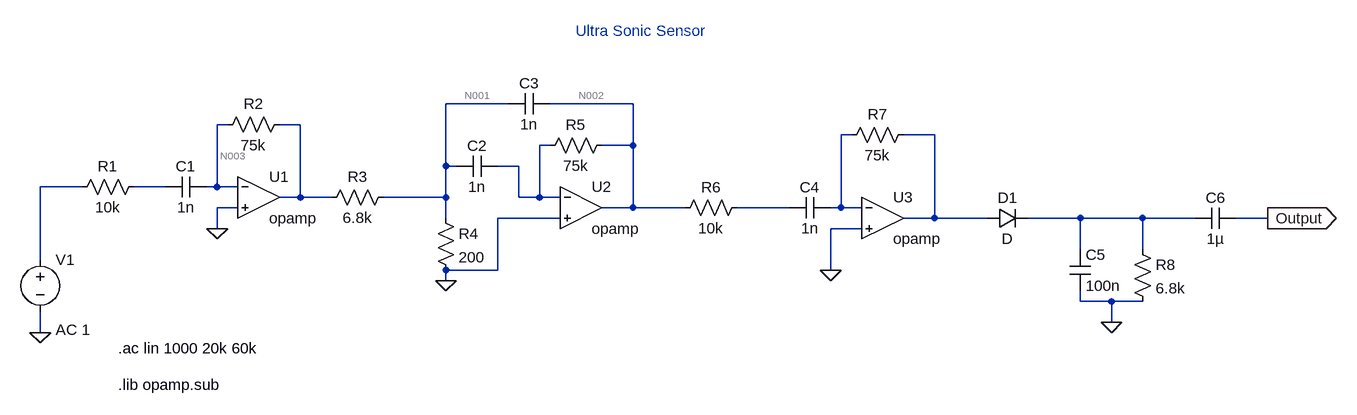
[diagram p0: schematic Ultrasonic.asc]
Ultrasonic.asc, the LTspice schematic file:
Version 4
SHEET 1 2076 712
WIRE 768 64 672 64
WIRE 960 64 832 64
WIRE 336 96 320 96
WIRE 448 96 416 96
WIRE 1296 112 1280 112
WIRE 1424 112 1376 112
WIRE 832 128 816 128
WIRE 960 128 960 64
WIRE 960 128 912 128
WIRE 672 160 672 64
WIRE 688 160 672 160
WIRE 784 160 752 160
WIRE 112 192 48 192
WIRE 240 192 192 192
WIRE 320 192 320 96
WIRE 320 192 304 192
WIRE 352 192 320 192
WIRE 448 208 448 96
WIRE 448 208 416 208
WIRE 496 208 448 208
WIRE 672 208 672 160
WIRE 672 208 576 208
WIRE 784 208 784 160
WIRE 816 208 816 128
WIRE 816 208 784 208
WIRE 848 208 816 208
WIRE 352 224 320 224
WIRE 960 224 960 128
WIRE 960 224 912 224
WIRE 1040 224 960 224
WIRE 1200 224 1120 224
WIRE 1280 224 1280 112
WIRE 1280 224 1264 224
WIRE 1312 224 1280 224
WIRE 672 240 672 208
WIRE 848 240 752 240
WIRE 1424 240 1424 112
WIRE 1424 240 1376 240
WIRE 1504 240 1424 240
WIRE 1648 240 1568 240
WIRE 1744 240 1648 240
WIRE 1824 240 1744 240
WIRE 1936 240 1888 240
WIRE 320 256 320 224
WIRE 1312 256 1264 256
WIRE 1648 288 1648 240
WIRE 1744 288 1744 240
WIRE 48 304 48 192
WIRE 752 320 752 240
WIRE 752 320 672 320
WIRE 1264 320 1264 256
WIRE 672 336 672 320
WIRE 1648 368 1648 352
WIRE 1696 368 1648 368
WIRE 1744 368 1696 368
WIRE 1696 400 1696 368
WIRE 48 416 48 384
FLAG 320 256 0
FLAG 672 336 0
FLAG 1696 400 0
FLAG 1264 320 0
FLAG 1936 240 Output
IOPIN 1936 240 Out
FLAG 48 416 0
SYMBOL res 208 176 R90
WINDOW 0 0 56 VBottom 2
WINDOW 3 32 56 VTop 2
SYMATTR InstName R1
SYMATTR Value 10k
SYMBOL cap 304 176 R90
WINDOW 0 0 32 VBottom 2
WINDOW 3 32 32 VTop 2
SYMATTR InstName C1
SYMATTR Value 1n
SYMBOL OpAmps\\opamp 384 144 R0
SYMATTR InstName U1
SYMBOL res 432 80 R90
WINDOW 0 0 56 VBottom 2
WINDOW 3 32 56 VTop 2
SYMATTR InstName R2
SYMATTR Value 75k
SYMBOL res 592 192 R90
WINDOW 0 0 56 VBottom 2
WINDOW 3 32 56 VTop 2
SYMATTR InstName R3
SYMATTR Value 6.8k
SYMBOL res 656 224 R0
SYMATTR InstName R4
SYMATTR Value 200
SYMBOL cap 752 144 R90
WINDOW 0 0 32 VBottom 2
WINDOW 3 32 32 VTop 2
SYMATTR InstName C2
SYMATTR Value 1n
SYMBOL cap 832 48 R90
WINDOW 0 0 32 VBottom 2
WINDOW 3 32 32 VTop 2
SYMATTR InstName C3
SYMATTR Value 1n
SYMBOL OpAmps\\opamp 880 160 R0
SYMATTR InstName U2
SYMBOL res 928 112 R90
WINDOW 0 0 56 VBottom 2
WINDOW 3 32 56 VTop 2
SYMATTR InstName R5
SYMATTR Value 75k
SYMBOL res 1136 208 R90
WINDOW 0 0 56 VBottom 2
WINDOW 3 32 56 VTop 2
SYMATTR InstName R6
SYMATTR Value 10k
SYMBOL cap 1264 208 R90
WINDOW 0 0 32 VBottom 2
WINDOW 3 32 32 VTop 2
SYMATTR InstName C4
SYMATTR Value 1n
SYMBOL OpAmps\\opamp 1344 176 R0
SYMATTR InstName U3
SYMBOL res 1392 96 R90
WINDOW 0 0 56 VBottom 2
WINDOW 3 32 56 VTop 2
SYMATTR InstName R7
SYMATTR Value 75k
SYMBOL diode 1504 256 R270
WINDOW 0 32 32 VTop 2
WINDOW 3 0 32 VBottom 2
SYMATTR InstName D1
SYMBOL res 1728 272 R0
SYMATTR InstName R8
SYMATTR Value 6.8k
SYMBOL cap 1632 288 R0
SYMATTR InstName C5
SYMATTR Value 100n
SYMBOL cap 1888 224 R90
WINDOW 0 0 32 VBottom 2
WINDOW 3 32 32 VTop 2
SYMATTR InstName C6
SYMATTR Value 1µ
SYMBOL voltage 48 288 R0
WINDOW 123 24 124 Left 2
WINDOW 39 0 0 Left 0
SYMATTR Value2 AC 1
SYMATTR InstName V1
SYMATTR Value ""
TEXT 168 440 Left 2 !.ac lin 1000 20k 60k
TEXT 168 496 Left 2 !.lib opamp.sub
TEXT 872 -48 Left 2 ;Ultra Sonic Sensor

The netlist it stands for:
* Ultrasonic.asc
R1 N009 N008 10k
C1 N003 N009 1n
XU1 N003 0 N004 opamp Aol=100K GBW=10Meg  ; pins invin noninvin out
R2 N004 N003 75k
R3 N001 N004 6.8k
R4 N001 0 200
C2 N007 N001 1n
C3 N002 N001 1n
XU2 N007 0 N002 opamp Aol=100K GBW=10Meg  ; pins invin noninvin out
R5 N002 N007 75k
R6 N010 N002 10k
C4 N005 N010 1n
XU3 N005 0 N006 opamp Aol=100K GBW=10Meg  ; pins invin noninvin out
R7 N006 N005 75k
D1 N006 N011 D
R8 N011 0 6.8k
C5 N011 0 100n
C6 Output N011 1µ
V1 N008 0 AC 1
.model D D
.lib standard.dio
.ac lin 1000 20k 60k
.lib opamp.sub
* Ultra Sonic Sensor
.backanno
.end

* Results of the author's LTspice run, read from the files saved beside the schematic
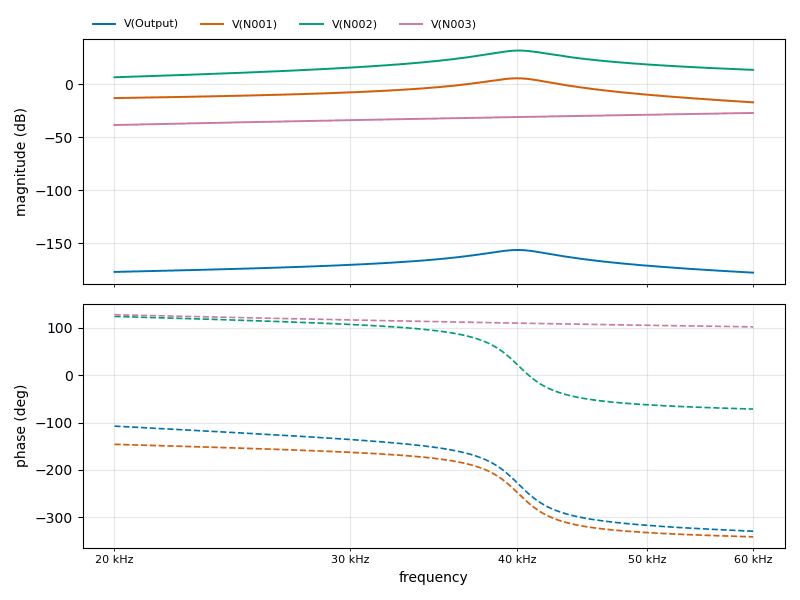
[diagram p1: AC Analysis of Ultrasonic.asc, plotted from the saved traces]
* AC Analysis, 1 run:
*   V(Output): -177.21 dB at 20 kHz, -177.89 dB at 60 kHz, peak -156.49 dB at 40.02 kHz, 3 dB below the peak at 38.02 kHz and 41.96 kHz
*   V(N001): -13.15 dB at 20 kHz, -17.14 dB at 60 kHz, peak 5.54 dB at 39.98 kHz, 3 dB below the peak at 37.96 kHz and 41.91 kHz
*   V(N002): 6.51 dB at 20 kHz, 13.51 dB at 60 kHz, peak 31.74 dB at 40.1 kHz, 3 dB below the peak at 38.19 kHz and 42.13 kHz
*   V(N003): -38.55 dB at 20 kHz, -27.14 dB at 60 kHz, peak -27.14 dB at 60 kHz, 3 dB below the peak at 43.65 kHz